# EAGLE design Mikrobus-Piggy-Back (EAGLE 7.7.0)
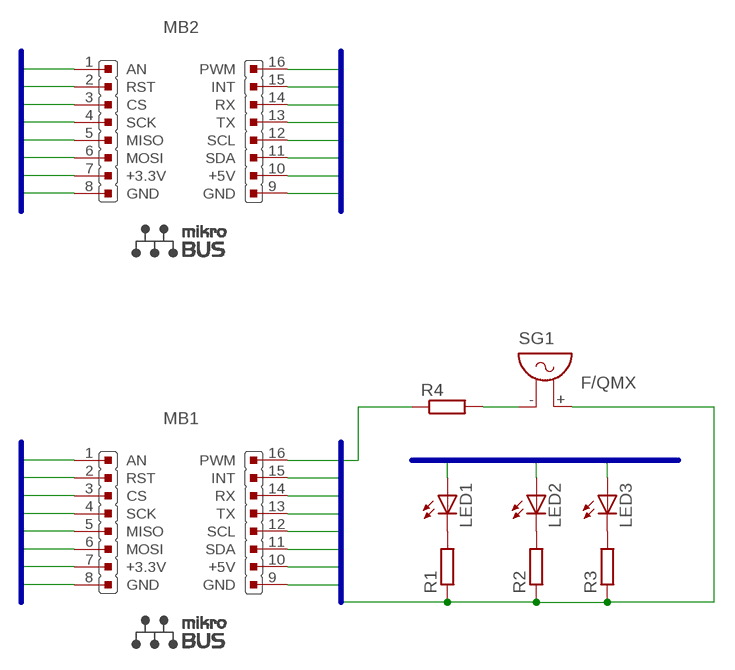
[diagram p0: schematic, sheet 1]

## Parts
LED1  LED3MM  [LED3MM]
LED2  LED3MM  [LED3MM]
LED3  LED3MM  [LED3MM]
MB1  MIKROBUS  [MIKROBUS]
MB2  MIKROBUS  [MIKROBUS]
R1  R-EU_0204/5  [0204/5]
R2  R-EU_0204/5  [0204/5]
R3  R-EU_0204/5  [0204/5]
R4  R-EU_0204/5  [0204/5]
SG1  F/QMX  [F/QMX]

## Nets
+3V3: MB1.7(+3.3V) MB2.7(+3.3V)
+5V: MB1.10(+5V) MB2.10(+5V)
AN: MB1.1(AN) MB2.1(AN)
CS: MB1.3(CS) MB2.3(CS)
GND: MB1.8(GND) MB1.9(GND) MB2.8(GND) MB2.9(GND) R1.1 R2.1 R3.1 SG1.+
INT: MB1.15(INT) MB2.15(INT)
MISO: MB1.5(MISO) MB2.5(MISO)
MOSI: MB1.6(MOSI) MB2.6(MOSI)
N$1: LED1.K(C) R1.2
N$2: LED2.K(C) R2.2
N$3: LED3.K(C) R3.2
N$4: R4.2 SG1.-
PWM: MB1.16(PWM) MB2.16(PWM) R4.1
RST: MB1.2(RST) MB2.2(RST)
RX: LED1.A MB1.14(RX) MB2.14(RX)
SCK: MB1.4(SCK) MB2.4(SCK)
SCL: LED3.A MB1.12(SCL) MB2.12(SCL)
SDA: MB1.11(SDA) MB2.11(SDA)
TX: LED2.A MB1.13(TX) MB2.13(TX)

## Buses
PWM,INT,RX,TX,SCL,SDA,+5V,GND
AN,RST,CS,SCK,MISO,MOSI,+3V3,GND
RX,TX,SCL,SDA

## Library data of the parts
LED1-LED3 = KS Lib2:LED: LED OSRAM: - CHIPLED LG R971, LG N971, LY N971, LG Q971, LY Q971, LO R971, LY R971 LH N974, LH R974 LS Q976, LO Q976, LY Q976 LO Q996 - Hyper CHIPLED LW Q18S LB Q993, LB Q99A, LB R99A - SideLED LS A670, LO A670, LY A670, LG A670, LP A670 LB A673, LV A673, LT A673, LW A673 LH A674 LY A675 LS A676, LA A676, LO A676, LY A676, LW A676 LS A679, LY A679, LG A679 - Hyper Micro SIDELED® LS Y876, LA Y876, LO Y876, LY Y876 LT Y87S - SmartLED LW L88C, LW L88S LB L89C, LB L89S, LG L890 LS L89K, LO L89K, LY L89K LS L896, LA L896, LO L896, LY L896 - TOPLED LS T670, LO T670, LY T670, LG T670, LP T670 LSG T670, LSP T670, LSY T670, LOP T670, LYG T670 LG T671, LOG T671, LSG T671 LB T673, LV T673, LT T673, LW T673 LH T674 LS T676, LA T676, LO T676, LY T676, LB T676, LH T676, LSB T676, LW T676 LB T67C, LV T67C, LT T67C, LS T67K, LO T67K, LY T67K, LW E67C LS E67B, LA E67B, LO E67B, LY E67B, LB E67C, LV E67C, LT E67C LW T67C LS T679, LY T679, LG T679 LS T770, LO T770, LY T770, LG T770, LP T770 LB T773, LV T773, LT T773, LW T773 LH T774 LS E675, LA E675, LY E675, LS T675 LS T776, LA T776, LO T776, LY T776, LB T776 LHGB T686 LT T68C, LB T68C - Hyper Mini TOPLED® LB M676 - Mini TOPLED Santana® LG M470 LS M47K, LO M47K, LY M47K Source: http://www.osram.convergy.de/
MB1 MB2 = KS Proto:MIKROBUS: MikroBUS Source: MikroBUS specification <http://www.mikroe.com/downloads/get/1737/mikrobus_specification.pdf> MikroBUS <http://www.mikroe.com/mikrobus/>
R1-R4 = KS Lib2:R-EU_: RESISTOR, European symbol
SG1 = buzzer:F/QMX: BUZZER Source: Buerklin; OC_FARNELL: unknown; OC_NEWARK: unknown

## Board
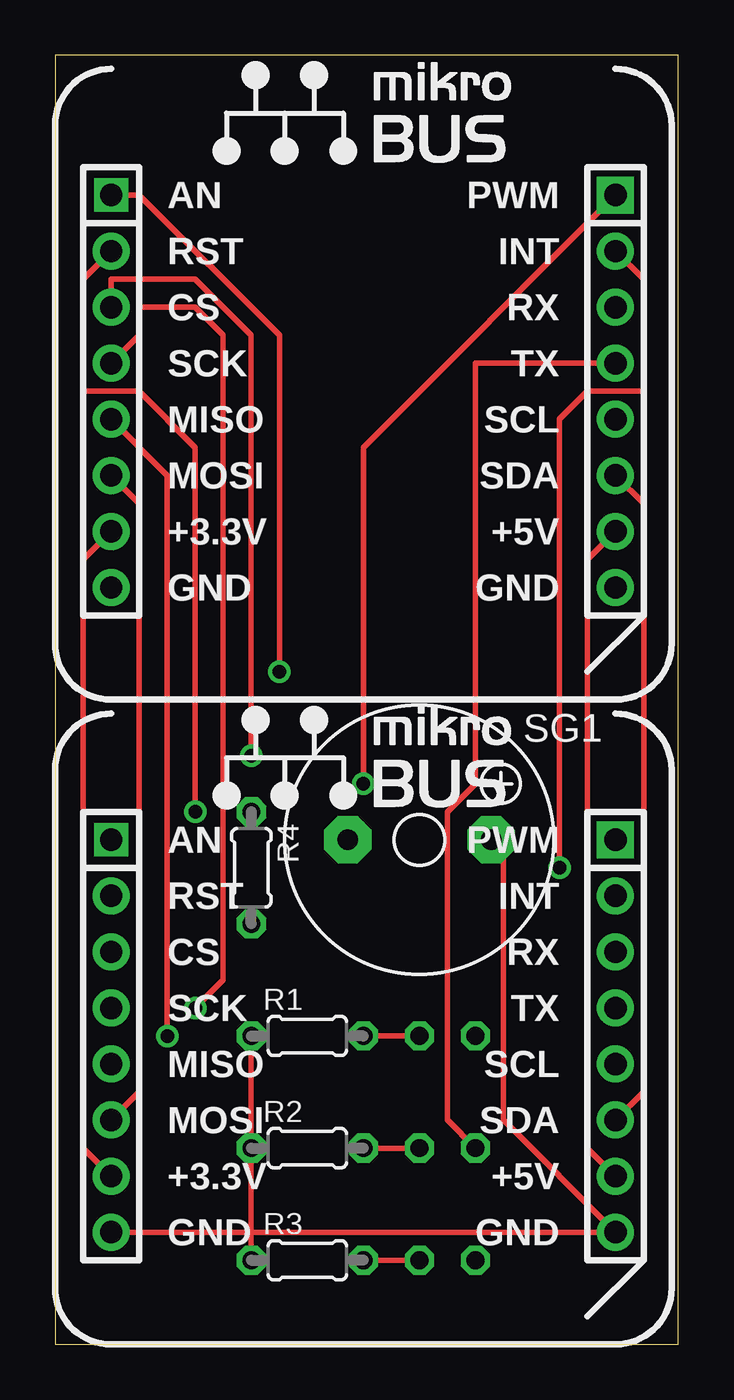
[diagram p1: board, top side]
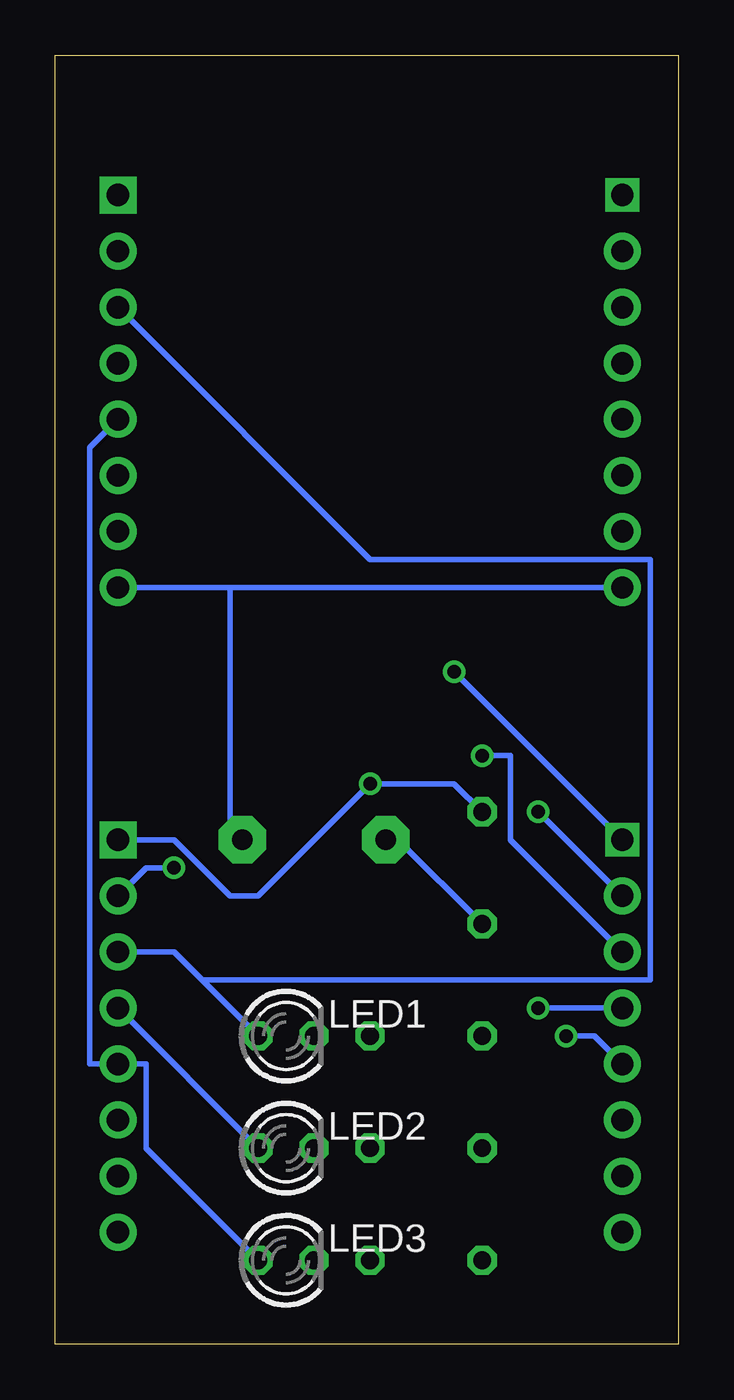
[diagram p2: board, bottom side, seen from below]

Size 28.25 x 58.41 mm. Coordinates in mm from the lower left corner, seen from the top.
Outline: 0,0 28.25,0 28.25,58.41 0,58.41 0,0
Copper layers (1*16): Top 0.035mm / dielectric 1.5mm / Bottom 0.035mm
Design rules "default": minimum track width 10mil, minimum drill 24mil, track to track 8mil, track to pad 8mil, pad to pad 8mil, via to via 8mil, smd to smd 8mil, copper to edge 40mil, drill to drill 8mil, minimum pad ring 10mil, minimum via ring 8mil, stop-mask expansion 4mil, vias tented up to drill 0mil, thermal gap 10mil

### Footprints (pad centres in the part's own frame; a part is rotated, then mirrored left to right if it is on the bottom)
LED3MM = drill 0.813 octagon: A -1.27,0; K 1.27,0
MIKROBUS = drill 1.016 square: 1 -11.43,7.62 | drill 1.016 pad 1.676: 2 -11.43,5.08; 3 -11.43,2.54; 4 -11.43,0; 5 -11.43,-2.54; 6 -11.43,-5.08; 7 -11.43,-7.62; 8 -11.43,-10.16; 9 11.43,-10.16; 10 11.43,-7.62; 11 11.43,-5.08; 12 11.43,-2.54; 13 11.43,0; 14 11.43,2.54; 15 11.43,5.08 | drill 1.016 pad 1.676 square: 16 11.43,7.62
0204/5 = drill 0.813 octagon: 1 -2.54,0; 2 2.54,0
F/QMX = drill 0.914 pad 2.159 octagon: + 3.251,0; - -3.251,0

### Placement (x,y rotation side)
LED1  17.78,13.97 0 bottom
LED2  17.78,8.89 0 bottom
LED3  17.78,3.81 0 bottom
MB1  13.97,15.24 0 top
MB2  13.97,44.45 0 top
R1  11.43,13.97 0 top
R2  11.43,8.89 0 top
R3  11.43,3.81 0 top
R4  8.89,21.59 270 top
SG1  16.51,22.86 0 top

### Tracks (layer width: path | path; a pad name or v marks a point on that pad's centre or on a via)
+3V3
  Top 0.254: MB1.7 1.27,8.89 1.27,35.56 MB2.7
+5V
  Top 0.254: MB1.10 24.13,8.89 24.13,35.56 MB2.10
AN  (via drill 0.61)
  Top 0.254: v10.16,30.48 10.16,45.72 3.81,52.07 MB2.1
  Bottom 0.254: v10.16,30.48 MB1.1
CS  (via drill 0.61)
  Top 0.254: v8.89,26.67 8.89,45.72 6.35,48.26 2.54,48.26 MB2.3
  Bottom 0.254: MB1.3 7.62,22.86 7.62,26.67 v8.89,26.67
GND
  Top 0.254: 8.89,5.08 R2.1 R1.1 | 8.89,5.08 R3.1 | 8.89,5.08 MB1.8 | 8.89,5.08 MB1.9 20.32,10.16 20.32,22.86 SG1.+
  Bottom 0.254: MB2.9 20.32,34.29 | 20.32,34.29 MB2.8 | 20.32,34.29 20.32,22.86 SG1.+
INT  (via drill 0.61)
  Top 0.254: v22.86,21.59 22.86,41.91 24.13,43.18 26.67,43.18 26.67,48.26 MB2.15
  Bottom 0.254: MB1.15 24.13,21.59 v22.86,21.59
MISO  (via drill 0.61)
  Top 0.254: v5.08,13.97 5.08,39.37 MB2.5
  Bottom 0.254: MB1.5 3.81,13.97 v5.08,13.97
MOSI
  Top 0.254: MB1.6 3.81,11.43 3.81,38.1 MB2.6
N$1
  Top 0.254: LED1.K R1.2
N$2
  Top 0.254: LED2.K R2.2
N$3
  Top 0.254: LED3.K R3.2
N$4
  Bottom 0.254: R4.2 12.7,22.86 SG1.-
PWM  (via drill 0.61)
  Top 0.254: MB2.16 13.97,40.64 v13.97,25.4
  Bottom 0.254: R4.1 10.16,25.4 v13.97,25.4 19.05,20.32 20.32,20.32 22.86,22.86 MB1.16
RST  (via drill 0.61)
  Top 0.254: v6.35,24.13 6.35,40.64 3.81,43.18 1.27,43.18 1.27,48.26 MB2.2
  Bottom 0.254: v6.35,24.13 MB1.2
RX
  Bottom 0.254: 21.59,16.51 22.86,17.78 MB1.14 | 21.59,16.51 LED1.A | MB2.14 13.97,35.56 1.27,35.56 1.27,16.51 21.59,16.51
SCK  (via drill 0.61)
  Top 0.254: v6.35,15.24 7.62,16.51 7.62,45.72 6.35,46.99 3.81,46.99 3.81,45.72 MB2.4
  Bottom 0.254: v6.35,15.24 MB1.4
SCL
  Bottom 0.254: LED3.A 24.13,8.89 24.13,12.7 MB1.12 26.67,12.7 26.67,40.64 MB2.12
SDA
  Top 0.254: MB1.11 26.67,11.43 26.67,38.1 MB2.11
TX
  Top 0.254: MB2.13 19.05,44.45 19.05,25.4 17.78,24.13 17.78,10.16 LED2.A
  Bottom 0.254: MB1.13 LED2.A